# Altium schematic sheet Programmer_Interface.SchDoc: Programmer Interface
size Tabloid; Date: 02/08/2023; Engineer: Terry D. schevker; Revision: 1.0; SheetNumber: 6; SheetTotal: 8
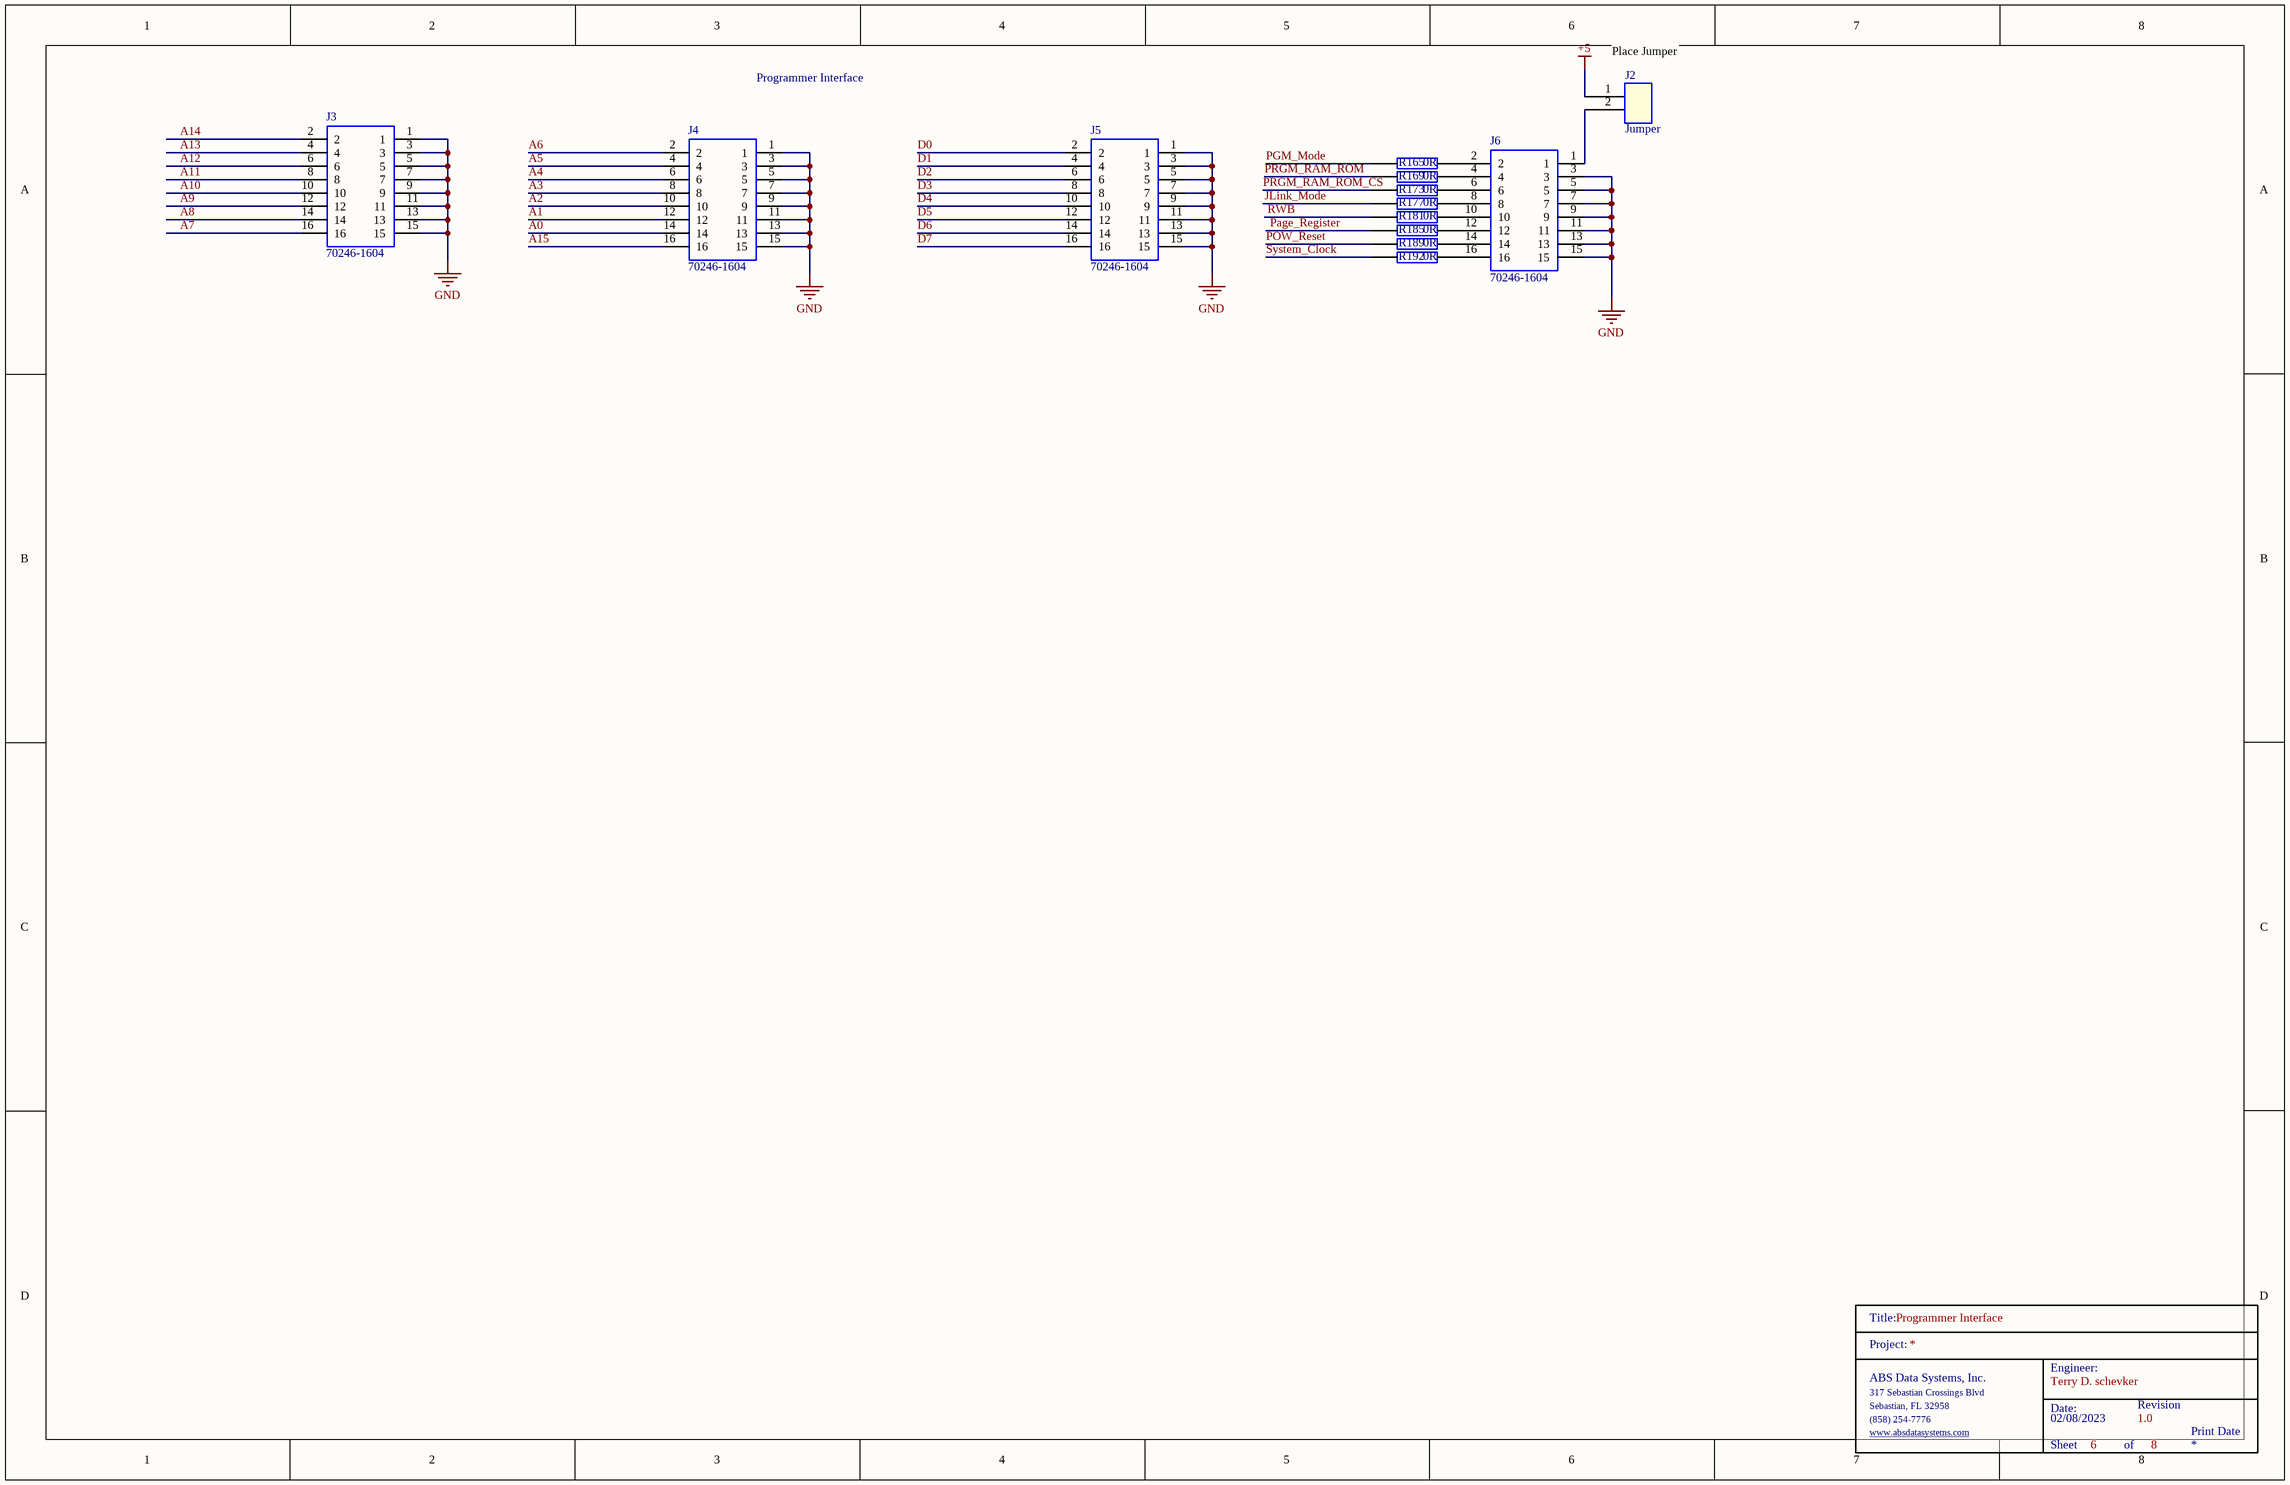
[diagram p0: Programmer_Interface.SchDoc]

## Parts
J2  Jumper  [Jumper]
J3  70246-1604  [SHDR16W99P254_2X8_2794X889X927P]
J4  70246-1604  [SHDR16W99P254_2X8_2794X889X927P]
J5  70246-1604  [SHDR16W99P254_2X8_2794X889X927P]
J6  70246-1604  [SHDR16W99P254_2X8_2794X889X927P]
R165  0R  [0603]
R169  0R  [0603]
R173  0R  [0603]
R177  0R  [0603]
R181  0R  [0603]
R185  0R  [0603]
R189  0R  [0603]
R192  0R  [0603]
TitleBlock_4  TitleBlock  (value not drawn)  (graphical)

## Nets
+5: J2.1
GND: J3.1 J3.3 J3.5 J3.7 J3.9 J3.11 J3.13 J3.15 J4.1 J4.3 J4.5 J4.7 J4.9 J4.11 J4.13 J4.15 J5.1 J5.3 J5.5 J5.7 J5.9 J5.11 J5.13 J5.15 J6.3 J6.5 J6.7 J6.9 J6.11 J6.13 J6.15
A0: J4.14
A1: J4.12
A2: J4.10
A3: J4.8
A4: J4.6
A5: J4.4
A6: J4.2
A7: J3.16
A8: J3.14
A9: J3.12
A10: J3.10
A11: J3.8
A12: J3.6
A13: J3.4
A14: J3.2
A15: J4.16
D0: J5.2
D1: J5.4
D2: J5.6
D3: J5.8
D4: J5.10
D5: J5.12
D6: J5.14
D7: J5.16
JLink_Mode: R177.1
Page_Register: R185.1
PGM_Mode: R165.1
POW_Reset: R189.1
PRGM_RAM_ROM: R169.1
PRGM_RAM_ROM_CS: R173.1
RWB: R181.1
System_Clock: R192.1
NetJ2_2: J2.2 J6.1
NetJ6_2: J6.2 R165.2
NetJ6_4: J6.4 R169.2
NetJ6_6: J6.6 R173.2
NetJ6_8: J6.8 R177.2
NetJ6_10: J6.10 R181.2
NetJ6_12: J6.12 R185.2
NetJ6_14: J6.14 R189.2
NetJ6_16: J6.16 R192.2

## Notes on the sheet
- Programmer Interface
- (near J2) Place Jumper on to use the 5V power supply from the Peripheral board.
- Print Date
- (in symbol TitleBlock) Title:; Project:; Engineer:; ABS Data Systems, Inc.; 317 Sebastian Crossings Blvd; Sebastian, FL 32958; Date:; Revision; (858) 254-7776; www.absdatasystems.com; Sheet; of

## Library data of the parts
J2 = Jumper: 16 Pin 3x8 Through Hold Jumprts; Manufacturer: Samtec; Manufacturer Part Number: TST-108-01-G-D; Number of Contacts: 16; Gender: Male; Connector Type: Male Pin; Pitch: 2.54mm; Row Spacing: 0.1inch; Supplier 1: Digi-Key; RoHS: Yes; Category: Headers and Wire Housings; Stock 1: 227; Pricing 1: 1=2.85000, 10=2.73600, 100=2.28000, 500=1.93800, 1000=1.65300, 5000=1.48200 (USD); Mount: Through Hole; Contact Plating: Gold; Contact Material: Bronze; Housing Material: Polyester; Housing Color: Black; Color: Black; Min Operating Temperature: -55°C; Max Operating Temperature: 125°C; Number of Rows: 2; Termination: Solder; Packaging: Rail/Tube; Orientation: Straight; Number of Positions: 16; Length: 27.94mm; Depth: 9.27mm; Contact Mating Length: 0.25inch; REACH SVHC: No SVHC; ComponentLink1URL: https://datasheet.ciiva.com/739/tst-mkt-739845.pdf?src-supplier=Digi-Key; ComponentLink1Description: https://datasheet.ciiva.com/739/tst-mkt-739845.pdf?src-supplier=Digi-Key; ComponentLink2URL: https://datasheet.ciiva.com/10018/htst-10018510.pdf?src-supplier=Avnet; ComponentLink2Description: https://datasheet.ciiva.com/10018/htst-10018510.pdf?src-supplier=Avnet
J3-J6 = 70246-1604: Molex C-GRID 70246, 2.54mm Pitch, 16 Way, 2 Row, Straight PCB Header, Through Hole; Geometry.Height: 9.27mm; Mouser Part Number: 538-70246-1604; Mouser Price/Stock: https://www.mouser.co.uk/ProductDetail/Molex/70246-1604?qs=KUIzHt%2Fe91njhb67Cjmalw%3D%3D; Manufacturer_Name: Molex; Manufacturer_Part_Number: 70246-1604; Datasheet Link: https://www.molex.com/pdm_docs/sd/702461604_sd.pdf
R165 R169 R173 R177 R181 R185 R189 R192 = RC0603JR-070RL: YAGEO 0603 0 ohm; Manufacturer_Name: KEMET; Geometry.Height: 0.55mm; Mouser Part Number: 603-RC0603JR-070RL; Mouser Price/Stock: https://www.mouser.co.uk/ProductDetail/YAGEO/RC0603JR-070RL?qs=2cAdsCoAWRGWyPcuXgGiXQ%3D%3D; Manufacturer_Part_Number: RC0603JR-070RL; Datasheet Link: https://datasheet.datasheetarchive.com/originals/distributors/Datasheets_SAMA/902f9e387b938f871d31120f5fc1d65e.pdf